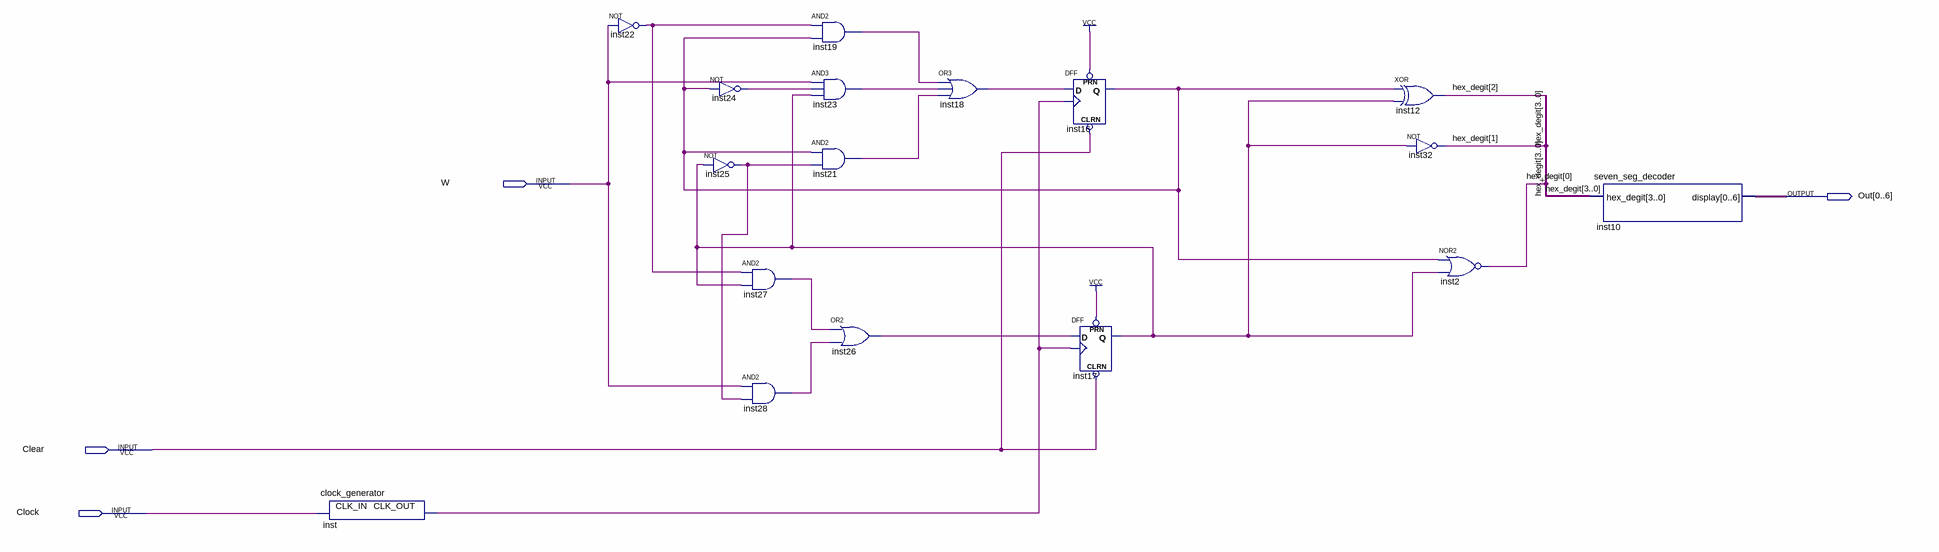
[diagram p0: schematic sheet]
// Quartus schematic counter4.bdf as structural Verilog: 17 symbols, 4 pins
module counter4 (
  input  W,
  input  Clear,
  input  Clock,
  output [0:6] Out
);

  wire inst16_q, inst17_q, inst18_out, inst19_out, inst21_out, inst22_out, inst23_out, inst24_out,
       inst25_out, inst26_out, inst27_out, inst28_out, inst_clk_out;
  wire [3:0] hex_degit;

  clock_generator inst (.CLK_IN(Clock), .CLK_OUT(inst_clk_out));
  not inst22 (inst22_out, W);
  not inst24 (inst24_out, inst16_q);
  not inst25 (inst25_out, inst17_q);
  and inst27 (inst27_out, inst22_out, inst17_q);
  and inst28 (inst28_out, W, inst25_out);
  and inst19 (inst19_out, inst22_out, inst16_q);
  and inst23 (inst23_out, W, inst24_out, inst17_q);
  and inst21 (inst21_out, inst16_q, inst25_out);
  or inst26 (inst26_out, inst27_out, inst28_out);
  or inst18 (inst18_out, inst19_out, inst23_out, inst21_out);
  DFF inst16 (.CLRN(Clear), .CLK(inst_clk_out), .D(inst18_out), .PRN(1'b1), .Q(inst16_q));
  DFF inst17 (.CLRN(Clear), .CLK(inst_clk_out), .D(inst26_out), .PRN(1'b1), .Q(inst17_q));
  xor inst12 (hex_degit[2], inst16_q, inst17_q);
  not inst32 (hex_degit[1], inst17_q);
  nor inst2 (hex_degit[0], inst16_q, inst17_q);
  seven_seg_decoder inst10 (.hex_degit(hex_degit), .display(Out));
endmodule
